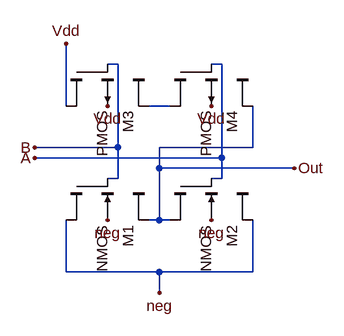
[diagram p0: schematic norLVS.asc]
norLVS.asc, the LTspice schematic file:
Version 4
SHEET 1 880 680
WIRE 112 16 96 16
WIRE 272 16 256 16
WIRE 32 80 32 -16
WIRE 192 80 160 80
WIRE 112 144 112 16
WIRE 112 144 -16 144
WIRE 320 144 320 80
WIRE 320 144 176 144
WIRE 272 160 272 16
WIRE 272 160 -16 160
WIRE 176 176 176 144
WIRE 384 176 176 176
WIRE 112 192 112 144
WIRE 112 192 96 192
WIRE 272 192 272 160
WIRE 272 192 256 192
WIRE 176 256 176 176
WIRE 176 256 160 256
WIRE 192 256 176 256
WIRE 32 336 32 256
WIRE 176 336 32 336
WIRE 320 336 320 256
WIRE 320 336 176 336
WIRE 176 368 176 336
FLAG 96 80 Vdd
FLAG 256 80 Vdd
FLAG 32 -16 Vdd
FLAG -16 144 B
FLAG -16 160 A
FLAG 384 176 Out
FLAG 176 368 neg
FLAG 96 256 neg
FLAG 256 256 neg
SYMBOL cktsym\\nmos4 96 256 R90
SYMATTR InstName M1
SYMATTR Value2 l=.9u w=3u
SYMBOL cktsym\\nmos4 256 256 R90
SYMATTR InstName M2
SYMATTR Value2 l=.9u w=3u
SYMBOL cktsym\\pmos4 96 80 R90
SYMATTR InstName M3
SYMATTR Value2 l=.9u w=6u
SYMBOL cktsym\\pmos4 256 80 R90
SYMATTR InstName M4
SYMATTR Value2 l=.9u w=6u

The netlist it stands for:
* norLVS.asc
M1 Out B neg neg NMOS l=.9u w=3u
M2 neg A Out neg NMOS l=.9u w=3u
M3 Vdd B N001 Vdd PMOS l=.9u w=6u
M4 N001 A Out Vdd PMOS l=.9u w=6u
.model NMOS NMOS
.model PMOS PMOS
.lib standard.mos
.backanno
.end